# EAGLE board JKW_standalone (EAGLE 6.4), part 1 of 2
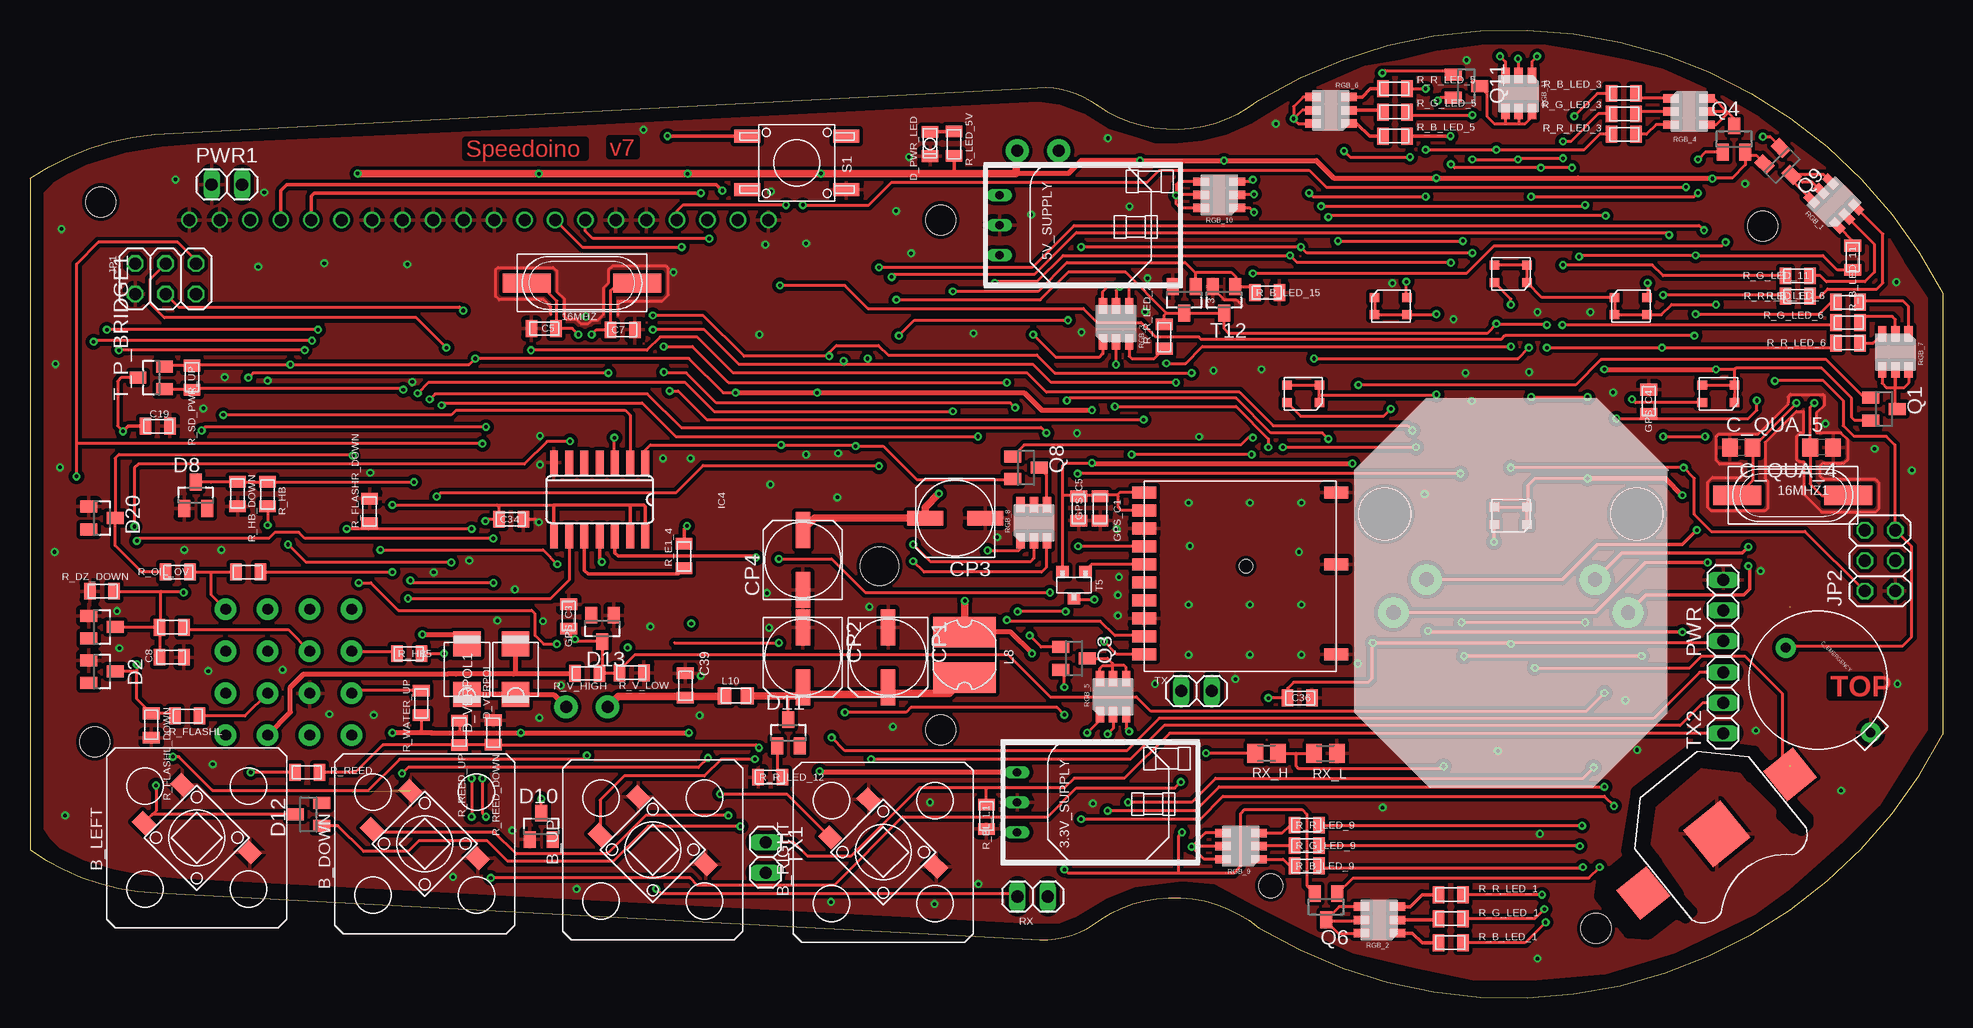
[diagram p3: board, top side]
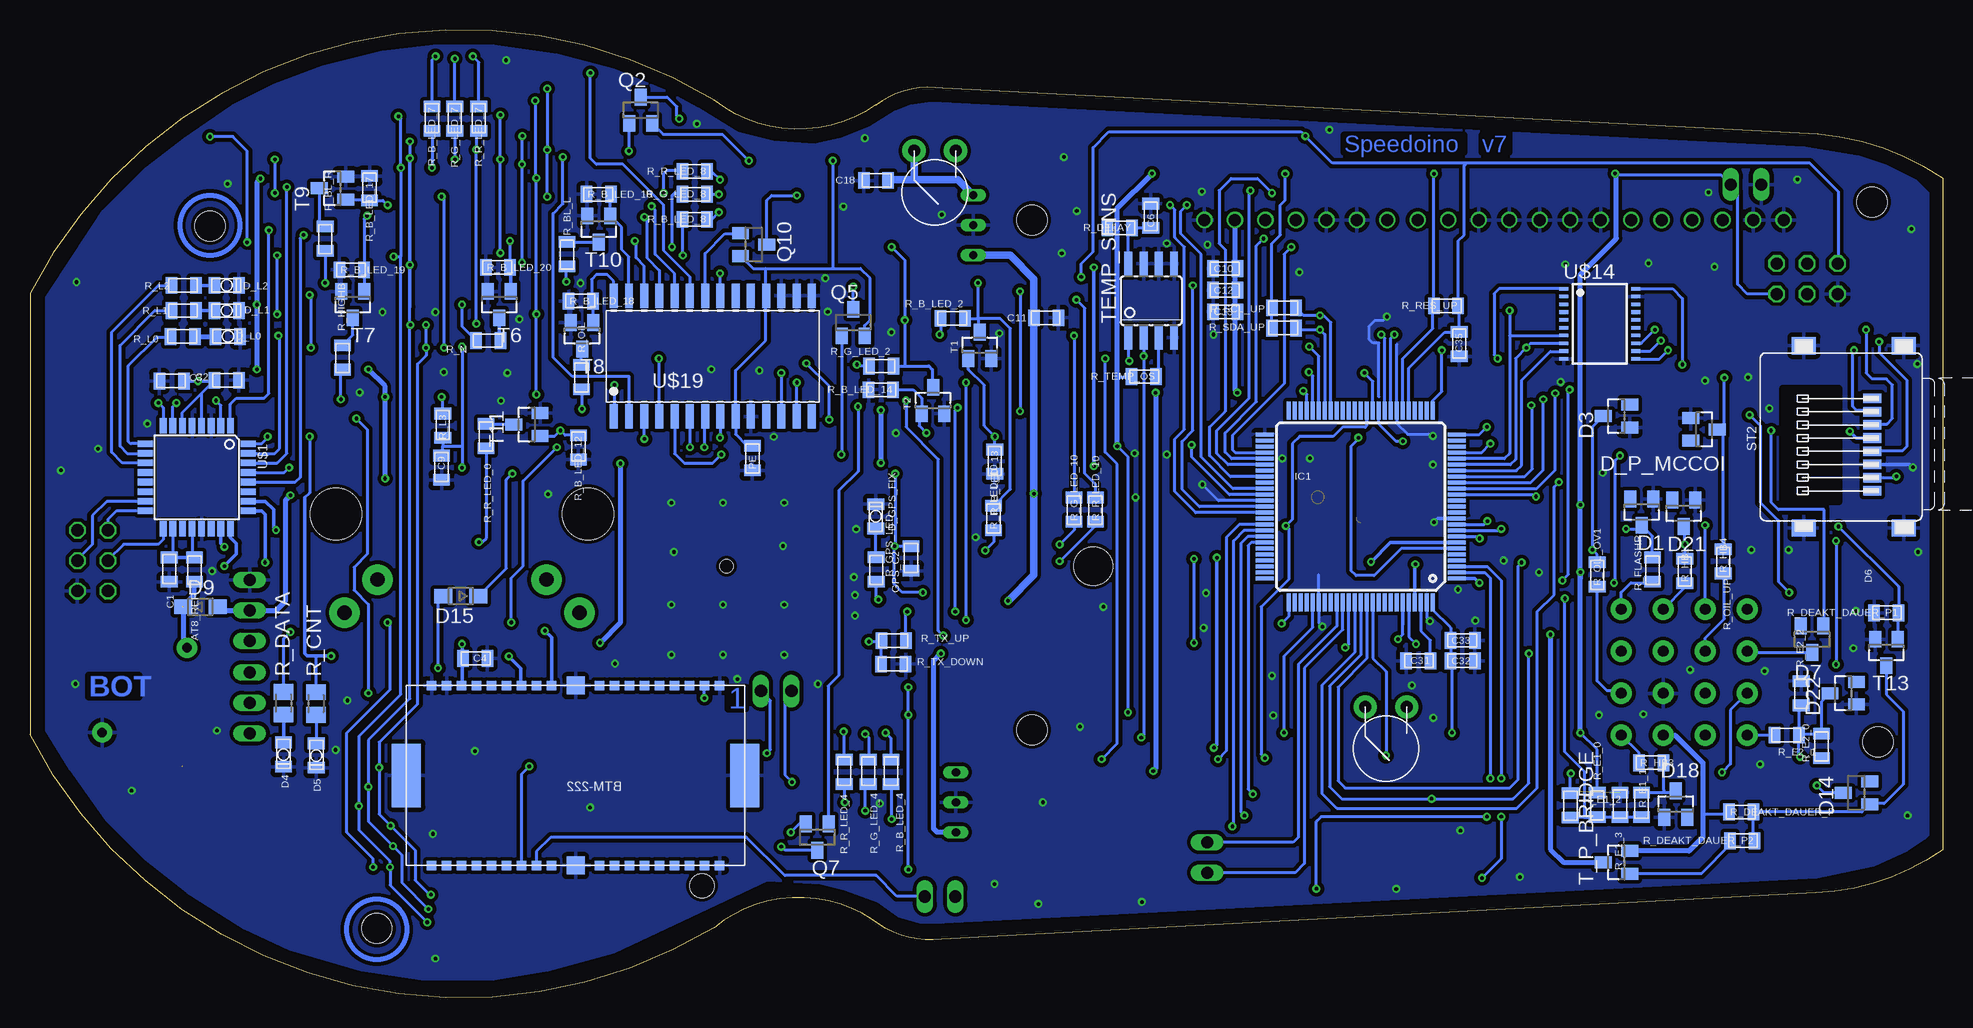
[diagram p4: board, bottom side, seen from below]

Size 159.4 x 80.69 mm. Coordinates in mm from the lower left corner, seen from the top.
Outline: 10.4,71.98 83.35,75.83
Outline: 10.41,71.98 arc29 0,68.34 0,12.34 arc33 10.6,8.74
Outline: 10.59,8.74 83.46,4.88
Outline: 83.32,75.82 arc-45 88.97,74.39
Outline: 88.91,74.44 arc73 102.4,74.84 arc-94 159.4,58.74 159.4,21.94 arc-94 102.4,5.84 arc73 89.17,6.5
Outline: 83.45,4.87 arc45 89.18,6.51
Copper layers (1*16): Top 0.035mm / dielectric 1.5mm / Bottom 0.035mm
Design rules "default": minimum track width 0.18mm, minimum drill 0.3mm, track to track 0.15mm, track to pad 0.15mm, pad to pad 0.15mm, via to via 0.15mm, smd to smd 0mil, copper to edge 0.1981mm, drill to drill 0.1981mm, minimum pad ring 0.18mm, minimum via ring 0.18mm, stop-mask expansion 0mil, vias tented up to drill 25mil, thermal gap 15mil
Net classes: 0 default: width 0.18 mm, drill 0.3 mm, clearance 0.15 mm
Holes 2.5 mm at 5.4,21.34 5.9,66.34 130.5,5.78 144.4,64.34
Holes 2 mm at 103.4,9.34
Holes 3.2 mm at 70.8,35.99
tKeepout: area 69.1,34.3 to 72.5,37.7; area 2.9,18.8 to 7.9,23.8; area 3.4,63.9 to 8.4,68.9
bKeepout: area 69.1,34.3 to 72.5,37.7
tRestrict: area 146,14 to 148.1,16; area 136.8,6.7 to 138.4,8.4; area 143.8,15.9 to 146.1,18.6; area 130.8,5.3 to 137.1,11.8; area 133,10.9 to 144.7,21.2; area 134.5,8.2 to 137.4,11.3

## Footprints (pad centres in the part's own frame; a part is rotated, then mirrored left to right if it is on the bottom)
OKI-78SR = drill 0.7 long: GND 0,-6.95; IN 2.5,-6.95; OUT -2.5,-6.95
POLY_FUSE = drill 1 pad 1.93: P$1 -1.73,0; P$2 1.73,0
XT-HC49S-SMD = smd 4 x 1.6: 1 -4.617,0; 2 4.617,0
0805 = smd 0.965 x 1.397: 1 -1.016,0; 2 1.016,0
SMD_DRUCKTASTER = smd 1.55 x 1.3 rotated 45: IN 1.22,4.402; IN2 -4.402,-1.22; OUT -1.22,-4.402
BTM-222 = smd 0.8 x 0.8: P$1 -12.635,-7.5; P$2 -11.385,-7.5; P$3 -10.135,-7.5; P$4 -8.885,-7.5; P$5 -7.635,-7.5; P$6 -6.385,-7.5; P$7 -5.135,-7.5; P$8 -3.885,-7.5; P$9 -2.635,-7.5; P$11 1.365,-7.5; P$12 2.615,-7.5; P$13 3.865,-7.5; P$14 5.115,-7.5; P$15 6.365,-7.5; P$16 7.615,-7.5; P$17 8.865,-7.5; P$18 10.115,-7.5; P$19 11.365,-7.5; P$20 11.365,7.5; P$21 10.115,7.5; P$22 8.865,7.5; P$23 7.615,7.5; P$24 6.365,7.5; P$25 5.115,7.5; P$26 3.865,7.5; P$27 2.615,7.5; P$28 1.365,7.5; P$30 -2.635,7.5; P$31 -3.885,7.5; P$32 -5.135,7.5; P$33 -6.385,7.5; P$34 -7.635,7.5; P$35 -8.885,7.5; P$36 -10.135,7.5; P$37 -11.385,7.5; P$38 -12.635,7.5 | smd 1.5 x 1.5: P$10 -0.635,-7.5; P$29 -0.635,7.5 | smd 2.4 x 5.3: P$AGND -14.735,0; P$BGND 13.465,0
GOLDCAP = drill 0.8 pad 1.676: MINUS -6.2,0; PLUS 3.8,0
C0805 = smd 1.3 x 1.5: 1 -0.95,0; 2 0.95,0
SMD/SMT_6.6/6.6 = smd 3 x 1.2: NEG -2.5,0; POS 2.5,0
SOT23 = smd 1 x 1.4: 1 -0.95,-1.1; 2 0.95,-1.1; 3 0,1.1
LED-0805 = smd 0.965 x 1.397: 1 -1.016,0; 2 1.016,0
SOD323-W = smd 1.5 x 1.2: A 1.45,0; C -1.45,0
PLCC-4 = smd 0.8 x 0.75: P$1 -1.35,0.725; P$2 -1.35,-0.725; P$3 1.35,-0.725; P$4 1.35,0.725
SMB = smd 2.1 x 2.3: A -2.114,0; K 2.114,0
MT3329 = smd 2 x 1: 3D-FIX -8.5,0.15; D+ -8.5,-1.35; D- -8.5,-2.85; EN -8.5,4.65; GND -8.5,3.15; GND2 -8.5,-4.35; GND_3 7.5,6.15; GND_4 7.5,0.15; GND_5 7.5,-7.35; RXD -8.5,-7.35; TXD -8.5,-5.85; VBACKUP -8.5,1.65; VCC -8.5,6.15 | hole 1.1: 0,0
BATTCON_12MM = smd 3.962 x 3.962: GND 0,0 | smd 3.175 x 3.175: PWR@1 -7.874,0; PWR@2 7.874,0
SO14 = smd 0.66 x 2.032: 1 -3.81,-3.073; 2 -2.54,-3.073; 3 -1.27,-3.073; 4 0,-3.073; 5 1.27,-3.073; 6 2.54,-3.073; 7 3.81,-3.073; 8 3.81,3.073; 9 2.54,3.073; 10 1.27,3.073; 11 0,3.073; 12 -1.27,3.073; 13 -2.54,3.073; 14 -3.81,3.073
TQFP100 = smd 1.5 x 0.35: 1 -8,6; 2 -8,5.5; 3 -8,5; 4 -8,4.5; 5 -8,4; 6 -8,3.5; 7 -8,3; 8 -8,2.5; 9 -8,2; 10 -8,1.5; 11 -8,1; 12 -8,0.5; 13 -8,0; 14 -8,-0.5; 15 -8,-1; 16 -8,-1.5; 17 -8,-2; 18 -8,-2.5; 19 -8,-3; 20 -8,-3.5; 21 -8,-4; 22 -8,-4.5; 23 -8,-5; 24 -8,-5.5; 25 -8,-6; 51 8,-6; 52 8,-5.5; 53 8,-5; 54 8,-4.5; 55 8,-4; 56 8,-3.5; 57 8,-3; 58 8,-2.5; 59 8,-2; 60 8,-1.5; 61 8,-1; 62 8,-0.5; 63 8,0; 64 8,0.5; 65 8,1; 66 8,1.5; 67 8,2; 68 8,2.5; 69 8,3; 70 8,3.5; 71 8,4; 72 8,4.5; 73 8,5; 74 8,5.5; 75 8,6 | smd 0.35 x 1.5: 26 -6,-8; 27 -5.5,-8; 28 -5,-8; 29 -4.5,-8; 30 -4,-8; 31 -3.5,-8; 32 -3,-8; 33 -2.5,-8; 34 -2,-8; 35 -1.5,-8; 36 -1,-8; 37 -0.5,-8; 38 0,-8; 39 0.5,-8; 40 1,-8; 41 1.5,-8; 42 2,-8; 43 2.5,-8; 44 3,-8; 45 3.5,-8; 46 4,-8; 47 4.5,-8; 48 5,-8; 49 5.5,-8; 50 6,-8; 76 6,8; 77 5.5,8; 78 5,8; 79 4.5,8; 80 4,8; 81 3.5,8; 82 3,8; 83 2.5,8; 84 2,8; 85 1.5,8; 86 1,8; 87 0.5,8; 88 0,8; 89 -0.5,8; 90 -1,8; 91 -1.5,8; 92 -2,8; 93 -2.5,8; 94 -3,8; 95 -3.5,8; 96 -4,8; 97 -4.5,8; 98 -5,8; 99 -5.5,8; 100 -6,8
2X03 = drill 1.016 octagon: 1 -2.54,-1.27; 2 -2.54,1.27; 3 0,-1.27; 4 0,1.27; 5 2.54,-1.27; 6 2.54,1.27
L-PD54 = smd 2.54 x 5.2: 1 -1.905,0; 2 1.905,0
0805+603 = smd 1.11 x 1.43: 1 -0.953,0; 2 0.953,0
NHD_2.7_SOLO_RO = drill 1: CS -102.51,24.5; DC -69.49,24.5; GND0 -61.87,24.5; GND1 -72.03,24.5; GND2 -74.57,24.5; GND3 -84.73,24.5; GND4 -87.27,24.5; GND5 -89.81,24.5; GND6 -92.35,24.5; GND7 -94.89,24.5; GND8 -107.59,24.5; GND9 -110.13,24.5; NC0 -66.95,24.5; NC1 -82.19,24.5; NC2 -97.43,24.5; NC3 -105.05,24.5; RES -99.97,24.5; SCLK -77.11,24.5; SDIN -79.65,24.5; VDD0 -64.41,24.5 | hole 2.5: -47.5,-18; -47.5,24.5
1X03 = drill 1.016 long: 1 -2.54,0; 2 0,0; 3 2.54,0
1X02 = drill 1.016 long: 1 -1.27,0; 2 1.27,0
M0805 = smd 1.3 x 1.6: 1 -0.95,0; 2 0.95,0
PLCC-6 = smd 1.3 x 0.7: 1+ 0,2.75; 1- 3,2.75; 2+ 0,1.65; 2- 3,1.65; 3+ 0,0.55; 3- 3,0.55
SW-ECO = smd 2.184 x 1.067: 1 -4.128,2.223; 2 -4.128,-2.223; 3 4.128,2.223; 4 4.128,-2.223
SPEEDOSTECKER = drill 0.9 pad 1.778: P$1 -2,5.5; P$2 -5.5,5.5; P$3 1.5,5.5; P$4 5,5.5; P$5 5,2; P$6 1.5,2; P$7 -2,2; P$8 -5.5,2; P$9 -5.5,-1.5; P$10 -2,-1.5; P$11 1.5,-1.5; P$12 5,-1.5; P$13 5,-5; P$14 1.5,-5; P$15 -2,-5; P$16 -5.5,-5
SD_MICRO = smd 0.8 x 1.5: 1 3.2,-9.35; 2 2.1,-9.35; 3 1,-9.35; 4 -0.1,-9.35; 5 -1.2,-9.35; 6 -2.3,-9.35; 7 -3.4,-9.35; 8 -4.5,-9.35 | smd 1.45 x 2: GND 7.6,-11.95; GND2 7.6,-3.65; GND3 -7.6,-11.95; GND4 -7.6,-3.65
STEPPER = drill 1.2 pad 2.54: 1+ 5.47,7.03; 1- 8.23,9.785; 2+ 8.23,-9.785; 2- 5.47,-7.03 | hole 4.3: 0,10.5; 0,-10.5
SOT-23 = smd 1.016 x 1.016: 1 0.953,1.111; 2 -0.952,1.111; 3 0,-1.111
SOIC8 = smd 0.66 x 2.032: 1 -1.975,-3.143; 2 -0.705,-3.143; 3 0.565,-3.143; 4 1.835,-3.143; 5 1.835,3.003; 6 0.565,3.003; 7 -0.705,3.003; 8 -1.975,3.003
TQFP8 = smd 1.27 x 0.559: 1 -4.293,2.8; 2 -4.293,2; 3 -4.293,1.2; 4 -4.293,0.4; 5 -4.293,-0.4; 6 -4.293,-1.2; 7 -4.293,-2; 8 -4.293,-2.8; 17 4.293,-2.8; 18 4.293,-2; 19 4.293,-1.2; 20 4.293,-0.4; 21 4.293,0.4; 22 4.293,1.2; 23 4.293,2; 24 4.293,2.8 | smd 0.559 x 1.27: 9 -2.8,-4.293; 10 -2,-4.293; 11 -1.2,-4.293; 12 -0.4,-4.293; 13 0.4,-4.293; 14 1.2,-4.293; 15 2,-4.293; 16 2.8,-4.293; 25 2.8,4.293; 26 2,4.293; 27 1.2,4.293; 28 0.4,4.293; 29 -0.4,4.293; 30 -1.2,4.293; 31 -2,4.293; 32 -2.8,4.293
TSSOP20 = smd 0.3 x 0.75: 1 -2.925,-3; 2 -2.275,-3; 3 -1.625,-3; 4 -0.975,-3; 5 -0.325,-3; 6 0.325,-3; 7 0.975,-3; 8 1.625,-3; 9 2.275,-3; 10 2.925,-3; 11 2.925,3; 12 2.275,3; 13 1.625,3; 14 0.975,3; 15 0.325,3; 16 -0.325,3; 17 -0.975,3; 18 -1.625,3; 19 -2.275,3; 20 -2.925,3
SOIC28 = smd 0.66 x 2.032: 1 -8.255,-5.029; 2 -6.985,-5.029; 3 -5.715,-5.029; 4 -4.445,-5.029; 5 -3.175,-5.029; 6 -1.905,-5.029; 7 -0.635,-5.029; 8 0.635,-5.029; 9 1.905,-5.029; 10 3.175,-5.029; 11 4.445,-5.029; 12 5.715,-5.029; 13 6.985,-5.029; 14 8.255,-5.029; 15 8.255,5.029; 16 6.985,5.029; 17 5.715,5.029; 18 4.445,5.029; 19 3.175,5.029; 20 1.905,5.029; 21 0.635,5.029; 22 -0.635,5.029; 23 -1.905,5.029; 24 -3.175,5.029; 25 -4.445,5.029; 26 -5.715,5.029; 27 -6.985,5.029; 28 -8.255,5.029

## Placement (x,y rotation side)
3.3V_SUPPLY  OKI78SR3.31.5WHC  [OKI-78SR]  89.2,16.29 270 top
5V_F  600mA  [POLY_FUSE]  84,70.62 180 bottom
5V_SUPPLY  OKI78SR51.5W36HC  [OKI-78SR]  87.75,64.42 270 top
12V_F1  1.1A  [POLY_FUSE]  46.4,24.24 180 bottom
16MHZ  16Mhz  [XT-HC49S-SMD]  46,59.59 180 top
16MHZ1  16Mhz  [XT-HC49S-SMD]  146.9,41.89 0 top
AT8_REF  10R  [0805]  145.7,35.69 90 bottom
B_DOWN  SMD_TASTER_MIT_KAPPE  [SMD_DRUCKTASTER]  32.9,12.84 270 top
B_LEFT  SMD_TASTER_MIT_KAPPE  [SMD_DRUCKTASTER]  13.9,13.34 270 top
B_RIGHT  SMD_TASTER_MIT_KAPPE  [SMD_DRUCKTASTER]  71.1,12.14 270 top
B_UP  SMD_TASTER_MIT_KAPPE  [SMD_DRUCKTASTER]  51.9,12.34 270 top
BLUETOOTH  BTM-222  [BTM-222]  114.57,18.53 180 bottom
C1  100nF  [0805]  147.8,35.69 270 bottom
C2  100nF  [0805]  147.6,51.42 0 bottom
C3  100nF  [0805]  143,51.48 180 bottom
C4  100nF  [0805]  122.3,28.29 180 bottom
C5  22pF  [0805]  42.8,55.79 180 top
C6  10µF  [0805]  66,65.19 90 bottom
C7  22pF  [0805]  49.4,55.69 0 top
C8  100nF  [0805]  11.8,28.39 0 top
C9  100nF  [0805]  125.1,44.19 270 bottom
C10  100nF  [0805]  59.8,60.79 0 bottom
C11  100n/20V  [0805]  74.72,56.69 0 bottom
C12  100nF  [0805]  59.8,58.99 0 bottom
C13  100nF  [0805]  59.8,57.19 0 bottom
C18  100n/20V  [0805]  88.9,68.14 180 bottom
C19  100nF  [0805]  10.64,47.66 180 top
C31  100nF  [0805]  43.7,28.09 180 bottom
C32  100nF  [0805]  40,28.09 0 bottom
C33  100nF  [0805]  40,29.79 0 bottom
C34  100nF  [0805]  40.1,39.89 0 top
C35  100nF  [0805]  40.3,54.49 270 bottom
C36  100nF  [0805]  105.8,24.99 180 top
C39  2µ2/100V  [0805]  54.61,26.04 90 top
C_EMERGENCY  DX-5R5H334U  [GOLDCAP]  149,26.49 135 top
C_QUA_4  22pF  [C0805]  149.3,45.89 180 top
C_QUA_5  22pF  [C0805]  142.6,45.89 0 top
CP1  330µF/16V  [SMD/SMT_6.6/6.6]  71.5,28.39 270 top
CP2  330µF/16V  [SMD/SMT_6.6/6.6]  64.4,28.39 270 top
CP3  330µF/16V  [SMD/SMT_6.6/6.6]  77.1,39.99 180 top
CP4  330µF/16V  [SMD/SMT_6.6/6.6]  64.4,36.49 90 top
D1  5.5V  [SOT23]  25.1,40.49 180 bottom
D2  5.5V  [SOT23]  6,27.19 270 top
D3  5.5V  [SOT23]  27.2,48.49 90 bottom
D4  Red  [LED-0805]  138.27,20.27 270 bottom
D5  Blue  [LED-0805]  135.54,20.19 270 bottom
D6  20V-Zdiode  [SOT23]  6,30.9 270 top
D7  771-PMBD7000235  [SOT23]  10.9,29.89 180 bottom
D8  5.5V  [SOT23]  13.8,41.89 0 top
D9  Mouser 726-BAT60AE6327  [SOD323-W]  145.2,32.59 0 bottom
D10  5.5V  [SOT23]  42.6,14.29 0 top
D11  20V-Zdiode  [SOT23]  63.2,22.09 0 top
D12  771-PMBD7000235  [SOT23]  23.2,15.29 90 top
D13  5.5V  [SOT23]  47.7,30.79 180 top
D14  771-PMBD7000235  [SOT23]  7.2,17.09 90 bottom
D15  Mouser 726-BAT60AE6327  [SOD323-W]  123.5,33.49 180 bottom
D18  78-MMBZ5232B-V  [SOT23]  22.25,16.14 0 bottom
D20  5.5V  [SOT23]  6,39.99 270 top
D21  5.5V  [SOT23]  21.6,40.39 180 bottom
D22  5.5V  [SOT23]  8.3,25.39 90 bottom
D_GPS_FIX  Red  [LED-0805]  88.92,40.14 90 bottom
D_GR_BLR  PLCC4_LED  [PLCC-4]  133.4,57.66 0 top
D_GR_N  PLCC4_LED  [PLCC-4]  123.4,60.34 180 top
D_L0  [LED-0805]  142.91,55.13 0 bottom
D_L1  [LED-0805]  143,57.29 0 bottom
D_L2  [LED-0805]  143,59.39 0 bottom
D_P_MCCOI  78-MMBZ5232B-V  [SOT23]  19.9,47.39 270 bottom
D_PWR_LED  Red  [LED-0805]  75,71.18 270 top
D_VERPOL  SS24T3G  [SMB]  40.45,27.39 270 top
D_VERPOL1  SS24T3G  [SMB]  36.4,27.39 270 top
GPS  MT3329  [MT3329]  101.35,35.99 0 top
GPS_BAT  F_908642  [BATTCON_12MM]  140.56,13.67 219 top
GPS_C1  100nF  [0805]  89.17,40.79 90 top
GPS_C2  100nF  [0805]  85.97,36.62 270 bottom
GPS_C3  100nF  [0805]  44.9,31.79 270 top
GPS_C4  100nF  [0805]  134.9,49.69 270 top
GPS_C5  100nF  [0805]  87.4,40.79 90 top
IC1  4093D  [SO14]  47.47,41.54 180 top
IC4  ATMEGA2560-16AU  [TQFP100]  48.5,40.95 180 bottom
JP1  ICSP  [2X03]  11.3,59.94 0 top
JP2  ICSP  [2X03]  154.18,36.44 90 top
L8  22µH 1A  [L-PD54]  77.88,28.59 90 top
L10  BLM21PG221SN1  [0805+603]  58.82,25.17 0 top
NHD_2.7  NHD_2.7_SOLO_RO  [NHD_2.7_SOLO_RO]  123.4,40.34 0 top
PE  100nF  [0805]  99.2,44.99 90 bottom
PWR  [1X03]  141.1,32.29 90 top
PWR1  [1X02]  16.4,67.79 0 top
Q1  BSS84  [SOT23]  154.5,49.09 270 top
Q2  BSS84  [SOT23]  108.5,73.99 0 bottom
Q3  BSS84  [SOT23]  87,28.29 270 top
Q4  BSS84  [SOT23]  142,71.59 0 top
Q5  BSS84  [SOT23]  90.8,56.29 0 bottom
Q6  BSS84  [SOT23]  108,7.59 180 top
Q7  BSS84  [SOT23]  93.8,13.39 180 bottom
Q8  BSS84  [SOT23]  83,44.19 270 top
Q9  BSS84  [SOT23]  146,69.39 225 top
Q10  BSS84  [SOT23]  99.1,62.79 270 bottom
Q11  BSS84  [SOT23]  119.7,75.99 270 top
R_B_LED_1  80R  [0805]  118.4,4.59 0 top
R_B_LED_2  80R  [0805]  82.5,56.64 0 bottom
R_B_LED_3  80R  [0805]  132.8,75.39 180 top
R_B_LED_4  80R  [0805]  87.65,18.84 270 bottom
R_B_LED_5  80R  [0805]  113.75,71.84 0 top
R_B_LED_6  80R  [0805]  151.5,57.99 180 top
R_B_LED_7  80R  [0805]  125.9,73.29 270 bottom
R_B_LED_8  80R  [0805]  104,64.89 180 bottom
R_B_LED_9  80R  [0805]  106.4,10.99 0 top
R_B_LED_10  80R  [0805]  79.1,39.99 90 bottom
R_B_LED_11  80R  [0805]  151.9,61.69 270 top
R_B_LED_12  10k  [0805]  113.7,45.89 270 bottom
R_B_LED_13  10k  [0805]  79,44.69 270 bottom
R_B_LED_14  10k  [0805]  88.5,50.69 180 bottom
R_B_LED_15  10k  [0805]  103.1,58.79 0 top
R_B_LED_16  10k  [0805]  112,66.99 0 bottom
R_B_LED_17  10k  [0805]  131.1,67.49 270 bottom
R_B_LED_18  10k  [0805]  113.5,58.09 0 bottom
R_B_LED_19  10k  [0805]  132.6,60.69 0 bottom
R_B_LED_20  10k  [0805]  120.4,60.89 0 bottom
R_BL_L  33R  [0805]  114.65,61.99 90 bottom
R_BL_L1  n.b.  [0805]  79.7,15.09 270 top
R_BL_R  33R  [0805]  134.8,63.29 90 bottom
R_CNT  220R  [M0805]  135.56,24.53 90 bottom
R_DATA  220R  [M0805]  138.27,24.55 90 bottom
R_DEAKT_DAUER_P  10k  [0805]  16.8,15.49 0 bottom
R_DEAKT_DAUER_P1  10k  [0805]  4.7,32.09 180 bottom
R_DEAKT_DAUER_P2  5k  [0805]  16.7,13.09 180 bottom
R_DELAY  300R  [0805]  68.6,64.19 180 bottom
R_DZ  5k  [0805]  11.81,30.88 180 top
R_DZ_DOWN  3k3  [0805]  6,33.89 180 top
R_E1_0  n.b.  [0805]  28.8,16.09 90 bottom
R_E1_1  n.b. / 0R  [0805]  25.1,16.09 270 bottom
R_E1_2  n.b.  [0805]  31.04,16.04 90 bottom
R_E1_3  n.b. / 0R  [0805]  26.9,16.09 270 bottom
R_E1_4  n.b.  [0805]  54.5,36.84 90 top
R_E2_0  n.b.  [0805]  10.1,20.99 90 bottom
R_E2_1  n.b. / 0R  [0805]  13,21.89 0 bottom
R_E2_2  n.b.  [0805]  11.8,25.39 90 bottom
R_FLASHL  10k  [0805]  13.1,23.49 180 top
R_FLASHL_DOWN  5k  [0805]  10.1,22.69 270 top
R_FLASHR  10k  [0805]  24.2,35.69 90 bottom
R_FLASHR_DOWN  5k  [0805]  28.3,40.59 90 top
R_G_LED_1  110R  [0805]  118.4,6.59 0 top
R_G_LED_2  110R  [0805]  88.47,52.67 0 bottom
R_G_LED_3  110R  [0805]  132.8,73.69 180 top
R_G_LED_4  110R  [0805]  89.55,18.84 270 bottom
R_G_LED_5  110R  [0805]  113.75,73.84 0 top
R_G_LED_6  110R  [0805]  151.5,56.29 180 top
R_G_LED_7  110R  [0805]  124,73.29 270 bottom
R_G_LED_8  110R  [0805]  104,66.99 180 bottom
R_G_LED_9  110R  [0805]  106.4,12.69 0 top
R_G_LED_10  110R  [0805]  72.4,40.69 90 bottom
R_G_LED_11  110R  [0805]  147.3,60.19 180 top
R_GPS_LED  1k  [0805]  88.88,35.72 90 bottom
R_GR_BL_L  PLCC4_LED  [PLCC-4]  113.4,57.66 0 top
R_HB  10k  [0805]  19.8,41.99 90 top
R_HB1  600R  [0805]  21.5,35.59 90 bottom
R_HB3  600R  [0805]  24.3,19.59 0 bottom
R_HB4  600R  [0805]  18.3,36.39 90 bottom
R_HB5  600R  [0805]  31.6,28.69 0 top
R_HB_DOWN  5k  [0805]  17.3,41.99 270 top
R_HIGHB  46R  [0805]  133.35,53.39 90 bottom
R_L0  1k  [0805]  146.67,55.13 0 bottom
R_L1  1k  [0805]  146.6,57.29 0 bottom
R_L2  1k  [0805]  146.6,59.39 0 bottom
R_L3  10k  [0805]  125,47.69 270 bottom
R_LED_5V  2k  [0805]  77,71.22 90 top
R_N  33R  [0805]  121.2,54.79 0 bottom
R_OIL  52R  [0805]  113.45,51.74 90 bottom
R_OIL_OV  1k  [0805]  12.3,35.49 180 top
R_OIL_OV1  1k  [0805]  28.8,35.29 90 bottom
R_OIL_UP  220R  [0805]  18.2,35.49 0 top
R_R_LED_0  52R  [0805]  121.4,46.84 90 bottom
R_R_LED_1  92R  [0805]  118.4,8.59 0 top
R_R_LED_2  92R  [0805]  94.53,55.14 90 top
R_R_LED_3  92R  [0805]  132.8,71.99 180 top
R_R_LED_4  92R  [0805]  91.55,18.84 270 bottom
R_R_LED_5  92R  [0805]  113.75,75.79 0 top
R_R_LED_6  92R  [0805]  151.5,54.59 180 top
R_R_LED_7  92R  [0805]  122,73.29 270 bottom
R_R_LED_8  92R  [0805]  104,68.89 180 bottom
R_R_LED_9  92R  [0805]  106.4,14.39 0 top
R_R_LED_10  92R  [0805]  70.6,40.69 90 bottom
R_R_LED_11  92R  [0805]  147.3,58.49 180 top
R_R_LED_12  220R  [0805]  61.7,18.39 0 top
R_REED  7k  [0805]  23.1,18.79 0 top
R_REED_DOWN  5k (12V Honda Signal) / 100nF (Reed)  [0805]  38.6,22.12 90 top
R_REED_UP  n.b.(Honda Signal) / 5k (Reed)  [0805]  35.8,22.09 270 top
R_RES_UP  10k  [0805]  41.4,57.69 180 bottom
R_SCL_UP  1k  [0805]  54.9,57.52 0 bottom
R_SD_PWR_UP  10k  [0805]  13.5,51.69 270 top
R_SDA_UP  1k  [0805]  54.9,55.84 0 bottom
R_TEMP_OS  10K  [0805]  66.6,51.79 180 bottom
R_TX_DOWN  2k7  [0805]  87.45,27.82 0 bottom
R_TX_UP  1k2  [0805]  87.42,29.77 0 bottom
R_V_HIGH  2k2  [0805]  46.45,27.04 0 top
R_V_LOW  1k  [0805]  50.15,27.09 0 top
R_WATER_UP  390R  [0805]  32.6,24.59 90 top
RGB_1  RGB_LED  [PLCC-6]  148.1,66.09 315 top
RGB_2  RGB_LED  [PLCC-6]  110.95,4.84 0 top
RGB_3  RGB_LED  [PLCC-6]  88.85,57.69 270 top
RGB_4  RGB_LED  [PLCC-6]  139.75,75.54 180 top
RGB_5  RGB_LED  [PLCC-6]  88.6,26.59 270 top
RGB_6  RGB_LED  [PLCC-6]  106.9,72.34 0 top
RGB_7  RGB_LED  [PLCC-6]  157.1,52.34 90 top
RGB_8  RGB_LED  [PLCC-6]  82,41.09 270 top
RGB_9  RGB_LED  [PLCC-6]  99.4,10.99 0 top
RGB_10  RGB_LED  [PLCC-6]  97.6,65.29 0 top
RGB_11  RGB_LED  [PLCC-6]  125.7,73.89 90 top
RX  [1X02]  83.56,8.44 0 top
RX_H  1k2  [M0805]  103.06,20.38 0 top
RX_L  2k7  [M0805]  107.95,20.38 180 top
S1  [SW-ECO]  63.91,69.6 180 top
SPEEDOSTECKER  SPEEDOSTECKER  [SPEEDOSTECKER]  21.8,26.89 0 top
ST2  SD_MICRO  [SD_MICRO]  15.22,46.76 90 bottom
STEPPER  STEPPER  [STEPPER]  123.4,40.34 270 top
T1  Mouser: 771-2N7002BK215 , N-Channel, 60V 350mA, SOT-23, 0,052€  [SOT23]  80.25,54.39 0 bottom
T2  Mouser: 771-2N7002BK215 , N-Channel, 60V 350mA, SOT-23, 0,052€  [SOT23]  84.15,49.79 0 bottom
T3  Mouser: 771-2N7002BK215 , N-Channel, 60V 350mA, SOT-23, 0,052€  [SOT23]  96.17,58.19 180 top
T5  Mouser: 771-2N7002BK215 , N-Channel, 60V 350mA, SOT-23, 0,052€  [SOT-23]  87,34.39 0 top
T6  Mouser: 771-2N7002BK215 , N-Channel, 60V 350mA, SOT-23, 0,052€  [SOT23]  120.3,57.79 180 bottom
T7  Mouser: 771-2N7002BK215 , N-Channel, 60V 350mA, SOT-23, 0,052€  [SOT23]  132.5,57.79 180 bottom
T8  Mouser: 771-2N7002BK215 , N-Channel, 60V 350mA, SOT-23, 0,052€  [SOT23]  113.4,55.19 180 bottom
T9  Mouser: 771-2N7002BK215 , N-Channel, 60V 350mA, SOT-23, 0,052€  [SOT23]  134.2,67.49 90 bottom
T10  Mouser: 771-2N7002BK215 , N-Channel, 60V 350mA, SOT-23, 0,052€  [SOT23]  112,64.09 180 bottom
T11  Mouser: 771-2N7002BK215 , N-Channel, 60V 350mA, SOT-23, 0,052€  [SOT23]  118,47.79 90 bottom
T12  Mouser: 771-2N7002BK215 , N-Channel, 60V 350mA, SOT-23, 0,052€  [SOT23]  99.5,58.19 180 top
T13  Mouser: 771-2N7002BK215 , N-Channel, 60V 350mA, SOT-23, 0,052€  [SOT23]  4.7,28.79 180 bottom
T_P_BRIDGE  PMV160UP215  [SOT23]  27.2,11.29 90 bottom
T_P_BRIDGE1  PMV160UP215  [SOT23]  10.1,51.69 90 top
TEMP_SENS  SE95D  [SOIC8]  65.9,58.19 0 bottom
TX  [1X02]  97.22,25.57 180 top
TX1  [1X02]  61.3,11.69 270 top
TX2  [1X03]  141.1,24.59 90 top
U$1  ATMEGA328P-AU  [TQFP8]  145.5,43.39 270 bottom
U$3  CLM4B-BKW-CTBVA363  [PLCC-4]  140.7,50.34 180 top
U$11  CLM4B-RKW-CWAXBAA3  [PLCC-4]  106.1,50.34 180 top
U$14  74LVC_LVCH245A  [TSSOP20]  28.6,56.19 270 bottom
U$19  MCP23017  [SOIC28]  102.5,53.49 0 bottom
U$22  CLM4B-RKW-CWAXBAA3  [PLCC-4]  123.4,40.19 180 top